# Altium schematic sheet LED Strip.SchDoc
size Letter; SheetNumber: 8; SheetTotal: 12
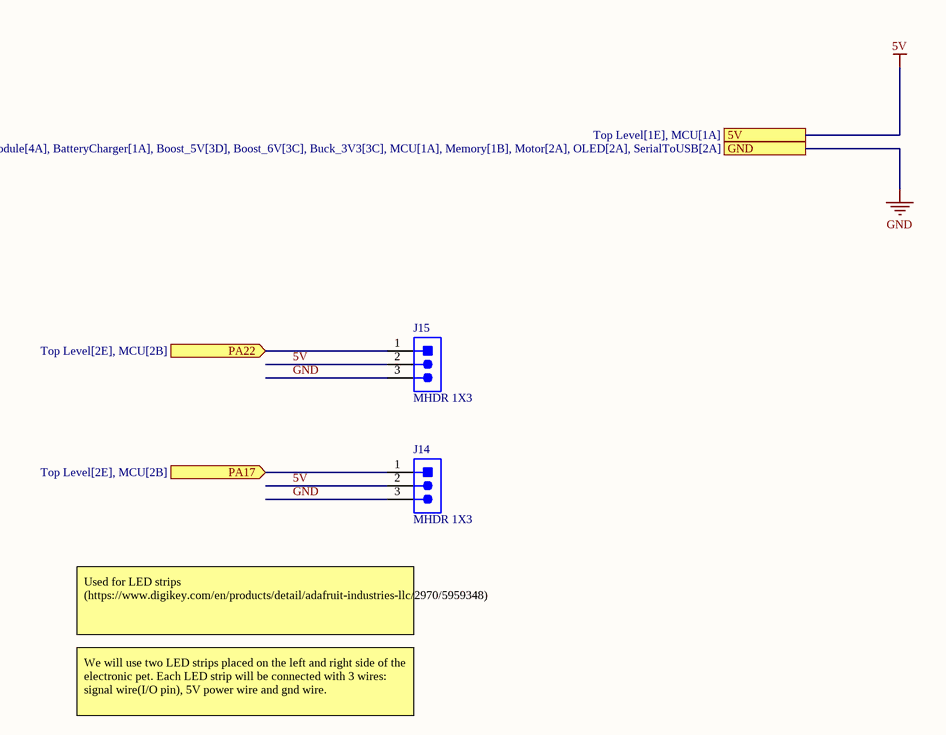
[diagram p0: LED Strip.SchDoc]

## Parts
J14  MHDR 1X3  [PH1-03-UA WITH CONNECTOR]
J15  MHDR 1X3  [PH1-03-UA WITH CONNECTOR]

## Ports
5V (see Top Level[1E], MCU[1A]), GND (see Top Level[1E], AI_Audio_Module[4A], BatteryCharger[1A], Boost_5V[3D], Boost_6V[3C], Buck_3V3[3C], MCU[1A], Memory[1B], Motor[2A], OLED[2A], SerialToUSB[2A]), PA17 (in, see Top Level[2E], MCU[2B]), PA22 (in, see Top Level[2E], MCU[2B])

## Nets
5V: J14.2 J15.2 ; port 5V
GND: J14.3 J15.3 ; port GND
PA17: J14.1 ; port PA17
PA22: J15.1 ; port PA22

## Notes on the sheet
- Used for LED strips (https://www.digikey.com/en/products/detail/adafruit-industries-llc/2970/5959348)
- We will use two LED strips placed on the left and right side of the electronic pet. Each LED strip will be connected with 3 wires: signal wire(I/O pin), 5V power wire and gnd wire.
- Title:
- Desc:
- Size:
- Letter
- Auth:
- Proj:
- Sheet
- of
- www.seas.upenn.edu
- Electrical and Systems Engineering

## Library data of the parts
J14 J15 = CMP-000023-1: Header, 3-Pin, 0.1in Pitch, Male